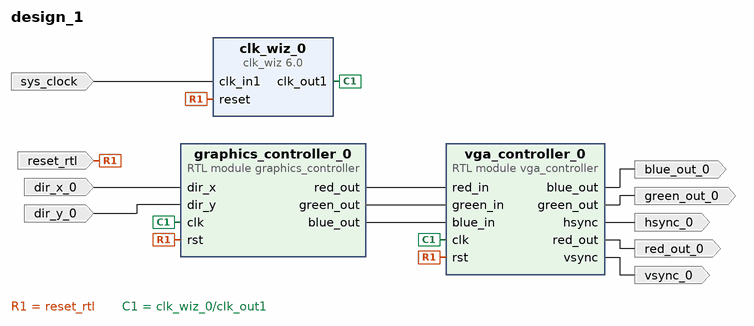
[diagram p0: block diagram of the top level]
# Vivado block design design_1, xc7z010clg400-1, Vivado 2019.1
create_bd_design design_1

create_bd_port -dir I -type rst reset_rtl
set_property -dict {CONFIG.POLARITY ACTIVE_HIGH} [get_bd_ports reset_rtl]
create_bd_port -dir I -type clk sys_clock
set_property -dict {CONFIG.FREQ_HZ 125000000 CONFIG.PHASE 0.000} [get_bd_ports sys_clock]
create_bd_port -dir O vsync_0
create_bd_port -dir O hsync_0
create_bd_port -dir I dir_x_0
create_bd_port -dir I dir_y_0
create_bd_port -dir O green_out_0
create_bd_port -dir O blue_out_0
create_bd_port -dir O red_out_0

create_bd_cell -type ip -vlnv xilinx.com:ip:clk_wiz:6.0 clk_wiz_0
set_property -dict [list \
  CONFIG.CLKOUT1_JITTER 610.719 \
  CONFIG.CLKOUT1_PHASE_ERROR 685.392 \
  CONFIG.CLKOUT1_REQUESTED_OUT_FREQ 34.694 \
  CONFIG.CLK_IN1_BOARD_INTERFACE sys_clock \
  CONFIG.MMCM_CLKFBOUT_MULT_F 57.625 \
  CONFIG.MMCM_CLKIN2_PERIOD 10.0 \
  CONFIG.MMCM_CLKOUT0_DIVIDE_F 18.875 \
  CONFIG.MMCM_DIVCLK_DIVIDE 11 \
  CONFIG.USE_BOARD_FLOW true \
] [get_bd_cells clk_wiz_0]
create_bd_cell -type module -reference vga_controller vga_controller_0
create_bd_cell -type module -reference graphics_controller graphics_controller_0

# ---- connections ----

connect_bd_net [get_bd_ports reset_rtl] [get_bd_pins clk_wiz_0/reset] [get_bd_pins vga_controller_0/rst] [get_bd_pins graphics_controller_0/rst]
connect_bd_net [get_bd_ports sys_clock] [get_bd_pins clk_wiz_0/clk_in1]
connect_bd_net [get_bd_pins clk_wiz_0/clk_out1] [get_bd_pins vga_controller_0/clk] [get_bd_pins graphics_controller_0/clk]
connect_bd_net [get_bd_pins vga_controller_0/vsync] [get_bd_ports vsync_0]
connect_bd_net [get_bd_pins vga_controller_0/hsync] [get_bd_ports hsync_0]
connect_bd_net [get_bd_pins graphics_controller_0/red_out] [get_bd_pins vga_controller_0/red_in]
connect_bd_net [get_bd_pins graphics_controller_0/green_out] [get_bd_pins vga_controller_0/green_in]
connect_bd_net [get_bd_pins graphics_controller_0/blue_out] [get_bd_pins vga_controller_0/blue_in]
connect_bd_net -net dir_x_0_1 [get_bd_ports dir_x_0] [get_bd_pins graphics_controller_0/dir_x]
connect_bd_net -net dir_y_0_1 [get_bd_ports dir_y_0] [get_bd_pins graphics_controller_0/dir_y]
connect_bd_net [get_bd_pins vga_controller_0/green_out] [get_bd_ports green_out_0]
connect_bd_net [get_bd_pins vga_controller_0/blue_out] [get_bd_ports blue_out_0]
connect_bd_net [get_bd_pins vga_controller_0/red_out] [get_bd_ports red_out_0]

validate_bd_design
save_bd_design
